# EAGLE schematic ovms_lilygo_tcall_pic (EAGLE 9.6.2)
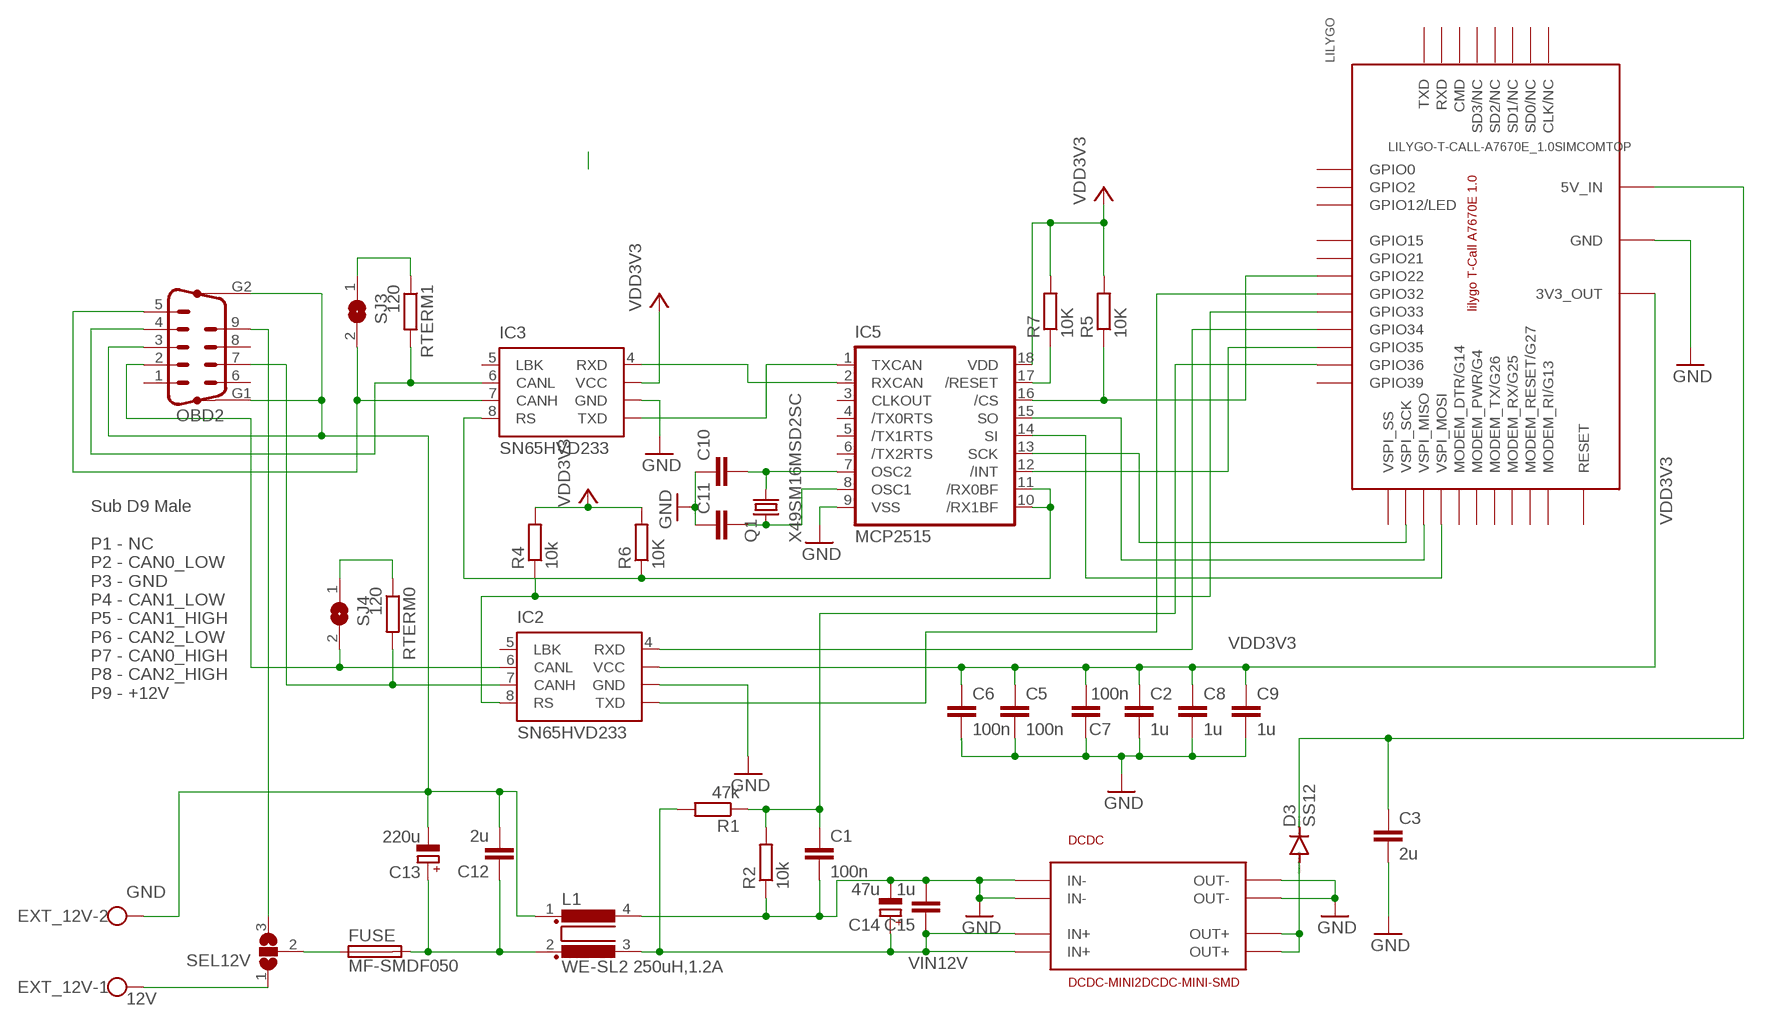
[diagram p0: schematic, sheet 1]

## Parts
C1  100n  C-EUC0805K  [C0805K]
C2  1u  C-EUC0805K  [C0805K]
C3  2u  C-EUC0805K  [C0805K]
C5  100n  C-EUC0805K  [C0805K]
C6  100n  C-EUC0805K  [C0805K]
C7  100n  C-EUC0805K  [C0805K]
C8  1u  C-EUC0805K  [C0805K]
C9  1u  C-EUC0805K  [C0805K]
C10  22pF  C-EUC0805K  [C0805K]
C11  22pF  C-EUC0805K  [C0805K]
C12  2u  C-EUC3216  [C3216]
C13  220u  CPOL-EUUD-8X10  [UD-8X10_NICHICON]
C14  47u  CPOL-EUSMCD  [SMC_D]
C15  1u  C-EUC3216  [C3216]
D3  SS12  DIODE-SOD123  [SOD123]
DCDC  DCDC-MINI2DCDC-MINI-SMD  [DCDC-MINI-SMD]
EXT_12V  GND  W237-102  [W237-102]
FUSE  MF-SMDF050  [MF-SMDF050]
IC2  SN65HVD233  SN65HVD23XS  [SO-08]
IC3  SN65HVD233  SN65HVD23XS  [SO-08]
IC5  MCP2515  MCP2510S  [SO-18W]
L1  WE-SL2 250uH,1.2A  CM-CHOKE-SMD  [CHOKE_SMD]
LILYGO  LILYGO-T-CALL-A7670E_1.0SIMCOMTOP  [LILYGO-TCALL-A7670E_1.0]
OBD2  M09HP  [M09HP]
Q1  X49SM16MSD2SC  KX-KS  [11.4X4.5]
R1  47k  R-EU_M0805  [M0805]
R2  10k  R-EU_M0805  [M0805]
R4  10k  R-EU_M0805  [M0805]
R5  10K  R-EU_M0805  [M0805]
R6  10K  R-EU_M0805  [M0805]
R7  10K  R-EU_M0805  [M0805]
RTERM0  120  R-EU_M0805  [M0805]
RTERM1  120  R-EU_M0805  [M0805]
SEL12V  SJ2W  [SJ_2]
SJ3  SJ  [SJ]
SJ4  SJ  [SJ]

## Nets
12V: C12.1 C13.+ FUSE.2 L1.2
EXT12V: EXT_12V.1 SEL12V.1
GND: C1.2 C2.2 C3.2 C5.2 C6.2 C7.1 C8.2 C9.2 C10.1 C11.1 C14.- C15.2 DCDC.IN-1(IN-) DCDC.IN-2(IN-) DCDC.OUT-1(OUT-) DCDC.OUT-2(OUT-) IC2.2(GND) IC3.2(GND) IC5.9(VSS) L1.4 LILYGO.1(GND) LILYGO.7(GND) LILYGO.25(GND) R2.1
GND1: C12.2 C13.- EXT_12V.2 L1.1 OBD2.3 OBD2.G1 OBD2.G2
N$1: IC3.1(TXD) IC5.1(TXCAN)
N$2: FUSE.1 SEL12V.2
N$3: IC3.4(RXD) IC5.2(RXCAN)
N$4: IC5.17(/RESET) R7.1
N$5: IC5.16(/CS) LILYGO.3(GPIO22) R5.1
N$6: IC3.8(RS) IC5.10(/RX1BF) IC5.11(/RX0BF) R6.1
N$7: C10.2 IC5.7(OSC2) Q1.2
N$9: IC2.4(RXD) LILYGO.34(GPIO34)
N$10: IC2.1(TXD) LILYGO.32(GPIO32)
N$11: IC2.6(CANL) OBD2.2 SJ4.2
N$15: IC2.8(RS) LILYGO.31(GPIO33) R4.1
N$16: IC2.7(CANH) OBD2.7 RTERM0.2
N$17: IC3.6(CANL) OBD2.4 RTERM1.2
N$18: IC3.7(CANH) OBD2.5 SJ3.2
N$21: C1.1 LILYGO.36(GPIO36) R1.1 R2.2
N$28: IC5.12(/INT) LILYGO.33(GPIO35)
N$30: C11.2 IC5.8(OSC1) Q1.1
N$32: IC5.13(SCK) LILYGO.9(VSPI_SCK)
N$33: IC5.15(SO) LILYGO.8(VSPI_MISO)
N$34: IC5.14(SI) LILYGO.2(VSPI_MOSI)
N$38: RTERM1.1 SJ3.1
N$39: RTERM0.1 SJ4.1
OBD12V: OBD2.9 SEL12V.3
VCC5V: C3.1 D3.C LILYGO.20(5V_IN)
VDD3V3: C2.1 C5.1 C6.1 C7.2 C8.1 C9.1 IC2.3(VCC) IC3.3(VCC) IC5.18(VDD) LILYGO.38(3V3_OUT) R4.2 R5.2 R6.2 R7.2
VIN5V: D3.A DCDC.OUT+1(OUT+) DCDC.OUT+2(OUT+)
VIN12V: C14.+ C15.1 DCDC.IN+1(IN+) DCDC.IN+2(IN+) L1.3 R1.2
Unconnected: IC2.5(LBK) IC3.5(LBK) IC5.3(CLKOUT) IC5.4(/TX0RTS) IC5.5(/TX1RTS) IC5.6(/TX2RTS) LILYGO.4(TXD) LILYGO.5(RXD) LILYGO.6(GPIO21) LILYGO.10(VSPI_SS) LILYGO.13(MODEM_PWR/G4) LILYGO.14(GPIO0) LILYGO.15(GPIO2) LILYGO.16(GPIO15) LILYGO.17(SD1/NC) LILYGO.18(SD0/NC) LILYGO.19(CLK/NC) LILYGO.21(CMD) LILYGO.22(SD3/NC) LILYGO.23(SD2/NC) LILYGO.24(MODEM_RI/G13) LILYGO.26(GPIO12/LED) LILYGO.27(MODEM_DTR/G14) LILYGO.28(MODEM_RESET/G27) LILYGO.29(MODEM_TX/G26) LILYGO.30(MODEM_RX/G25) LILYGO.35(GPIO39) LILYGO.37(RESET) OBD2.1 OBD2.6 OBD2.8

## Notes on the sheet
- Sub D9 Male
  
  P1 - NC
  P2 - CAN0_LOW
  P3 - GND
  P4 - CAN1_LOW
  P5 - CAN1_HIGH
  P6 - CAN2_LOW
  P7 - CAN0_HIGH
  P8 - CAN2_HIGH
  P9 - +12V

## Library data of the parts
C1-C3 C5-C12 C15 = rcl:C-EU: CAPACITOR, European symbol; SPICEPREFIX: C
C13 C14 = rcl:CPOL-EU: POLARIZED CAPACITOR, European symbol; SPICEPREFIX: C
D3 = diode:DIODE-: DIODE
DCDC = ovms_lilygo:DCDC-MINI2: DC/DC Step-Down Converter 0.8-20V
EXT_12V = con-wago-500:W237-102: WAGO SCREW CLAMP; MPN: 237-102; OC_FARNELL: unknown; OC_NEWARK: 70K9898; VIN: 12V
FUSE = ovms_lilygo:MF-SMDF: MF-SMDF Series - PRC Resettable Fuses Source: http://www.farnell.com/datasheets/716597.pdf
IC2 IC3 = ovms_lilygo:SN65HVD23X
IC5 = microchip:MCP2510
L1 = ovms_lilygo:CM-CHOKE: Common mode choke MSD7342 (SMD); OC_FARNELL: unknown; OC_NEWARK: unknown
LILYGO = ovms_lilygo:LILYGO-T-CALL-A7670E_1.0: Liliygo T-Call A7670E V1.0 Modul
OBD2 = con-subd:M09HP: SUB-D; OC_FARNELL: unknown; OC_NEWARK: unknown
Q1 = crystal-geyer_V1_0:KX: Quartz Crystals (MHz) SMD: KX - Serie Model Size l/w/h [mm] Frequency Range Frequency Stability Temp. Range [°C] Load Capacitance AECQ 200 availabel Datasheet KX-4 KX-5 KX-6 KX-7 KX-9A KX-9B KX-12A KX-12B KX-13 KX-20 KX-K KX-KS 1.6/1.2/0.3 2.0/1.6/0.45 2.5/2.0/0.55 3.2/2.5/0.8 5.0/3.2/1.0 5.0/3.2/1.1 6.0/3.5/1.1 6.0/3.5/1.0 7.0/5.0 /1.3 11.6/5.5/1.6 12.3/4.5/4.2 12.3/4.5/3.2 24.0 ~ 80.0 MHz 16.0 ~ 80.0 MHz 12.0 ~ 80.0 MHz 8.0 ~ 60.0 MHz 7,68 ~ 300,0 MHz 8,0 ~ 50,0 MHz 8,0 ~ 150,0 MHz 8,0 ~ 50,0 MHz 6,0 ~ 160,0 MHz 3,579 ~ 25,0 MHz 3,579 ~ 70,0 MHz 3,579 ~ 70,0 MHz ±10 … ±50ppm ±10 … ±50ppm ±10 … ±50ppm ±10 … ±50ppm ±10 … ±50ppm ±10 … ±50ppm ±10 … ±50ppm ±10 … ±50ppm ±10 … ±50ppm ±50ppm ±10 … ±50ppm ±10 … ±50ppm (*) -40°C …+85°C (*) -40°C …+125°C (*) -40°C …+125°C (*) -40°C …+125°C (*) -40°C …+105°C (*) -40°C …+105°C (*) -40°C …+125°C (*) -40°C …+105°C (*) -40°C …+105°C (*) -40°C …+105°C (*) -40°C …+85°C (*) -40°C …+85°C 8, 8…16 8, 8…16 10, 8…16 12, 7…20 16, 10…20 16, 10…20 16, 10…20 16, 12…20 16, 12…20 16, 12…20 16, 12…30 16, 12…30 - yes yes yes - - - - - - - - KX-4.pdf <http://www.geyer-electronic.de/uploads/tx_userartikelfrequenz/GEYER-KX-4.pdf> KX-5.pdf <http://www.geyer-electronic.de/uploads/tx_userartikelfrequenz/GEYER-KX-5.pdf> KX-6.pdf <http://www.geyer-electronic.de/uploads/tx_userartikelfrequenz/GEYER-KX-6.pdf> KX-7.pdf <http://www.geyer-electronic.de/uploads/tx_userartikelfrequenz/GEYER-KX-7.pdf> KX-9A.pdf <http://www.geyer-electronic.de/uploads/tx_userartikelfrequenz/GEYER-KX-9A.pdf> KX-9B.pdf <http://www.geyer-electronic.de/uploads/tx_userartikelfrequenz/GEYER-KX-9B.pdf> KX-12A.pdf <http://www.geyer-electronic.de/uploads/tx_userartikelfrequenz/GEYER-KX-12A.pdf> KX-12B.pdf <http://www.geyer-electronic.de/uploads/tx_userartikelfrequenz/GEYER-KX-12B.pdf> KX-13.pdf <http://www.geyer-electronic.de/uploads/tx_userartikelfrequenz/GEYER-KX-13.pdf> KX-20.pdf <http://www.geyer-electronic.de/uploads/tx_userartikelfrequenz/GEYER-KX-20.pdf> KX-K.pdf <http://www.geyer-electronic.de/uploads/tx_userartikelfrequenz/GEYER-KX-K.pdf> KX-KS.pdf <http://www.geyer-electronic.de/uploads/tx_userartikelfrequenz/GEYER-KX-KS.pdf> <http://www.geyer-electronic.de/fileadmin/template/img/logo-geyer-electronic.png> Details see: http://www.geyer-electronic.de/Frequenz-Produkte.9.0.html Created 2016-06-07, Hans Locher 2016 (C) Geyer Quartz Technology KX4,KX5,KX6,KX7,KX9A,KX9B,KX12A,KX12B,KX13,KX20,KXK,KXKS;1612;2016;2520;3225;5032;6035;7050;11655;12345;1,6x1,2;2,0x1,6;2,5x2,0;3,2x2,5;5,0x3,2;6,0x3,5;7,0x5,0;11,6x5,5;12,3x4,5;12,3x4,5;1.6x1.2;2.0x1.6;2.5x2.0;3.2x2.5;5.0x3.2;6.0x3.5;7.0x5.0;11.6x5.5;12.3x4.5;12.3x4.5;
R1 R2 R4-R7 RTERM0 RTERM1 = rcl:R-EU_: RESISTOR, European symbol; SPICEPREFIX: R
SEL12V = jumper:SJ2W: SMD solder JUMPER
SJ3 SJ4 = jumper:SJ: SMD solder JUMPER